# EAGLE schematic Dveri_Zapaishek (EAGLE 7.0.0)
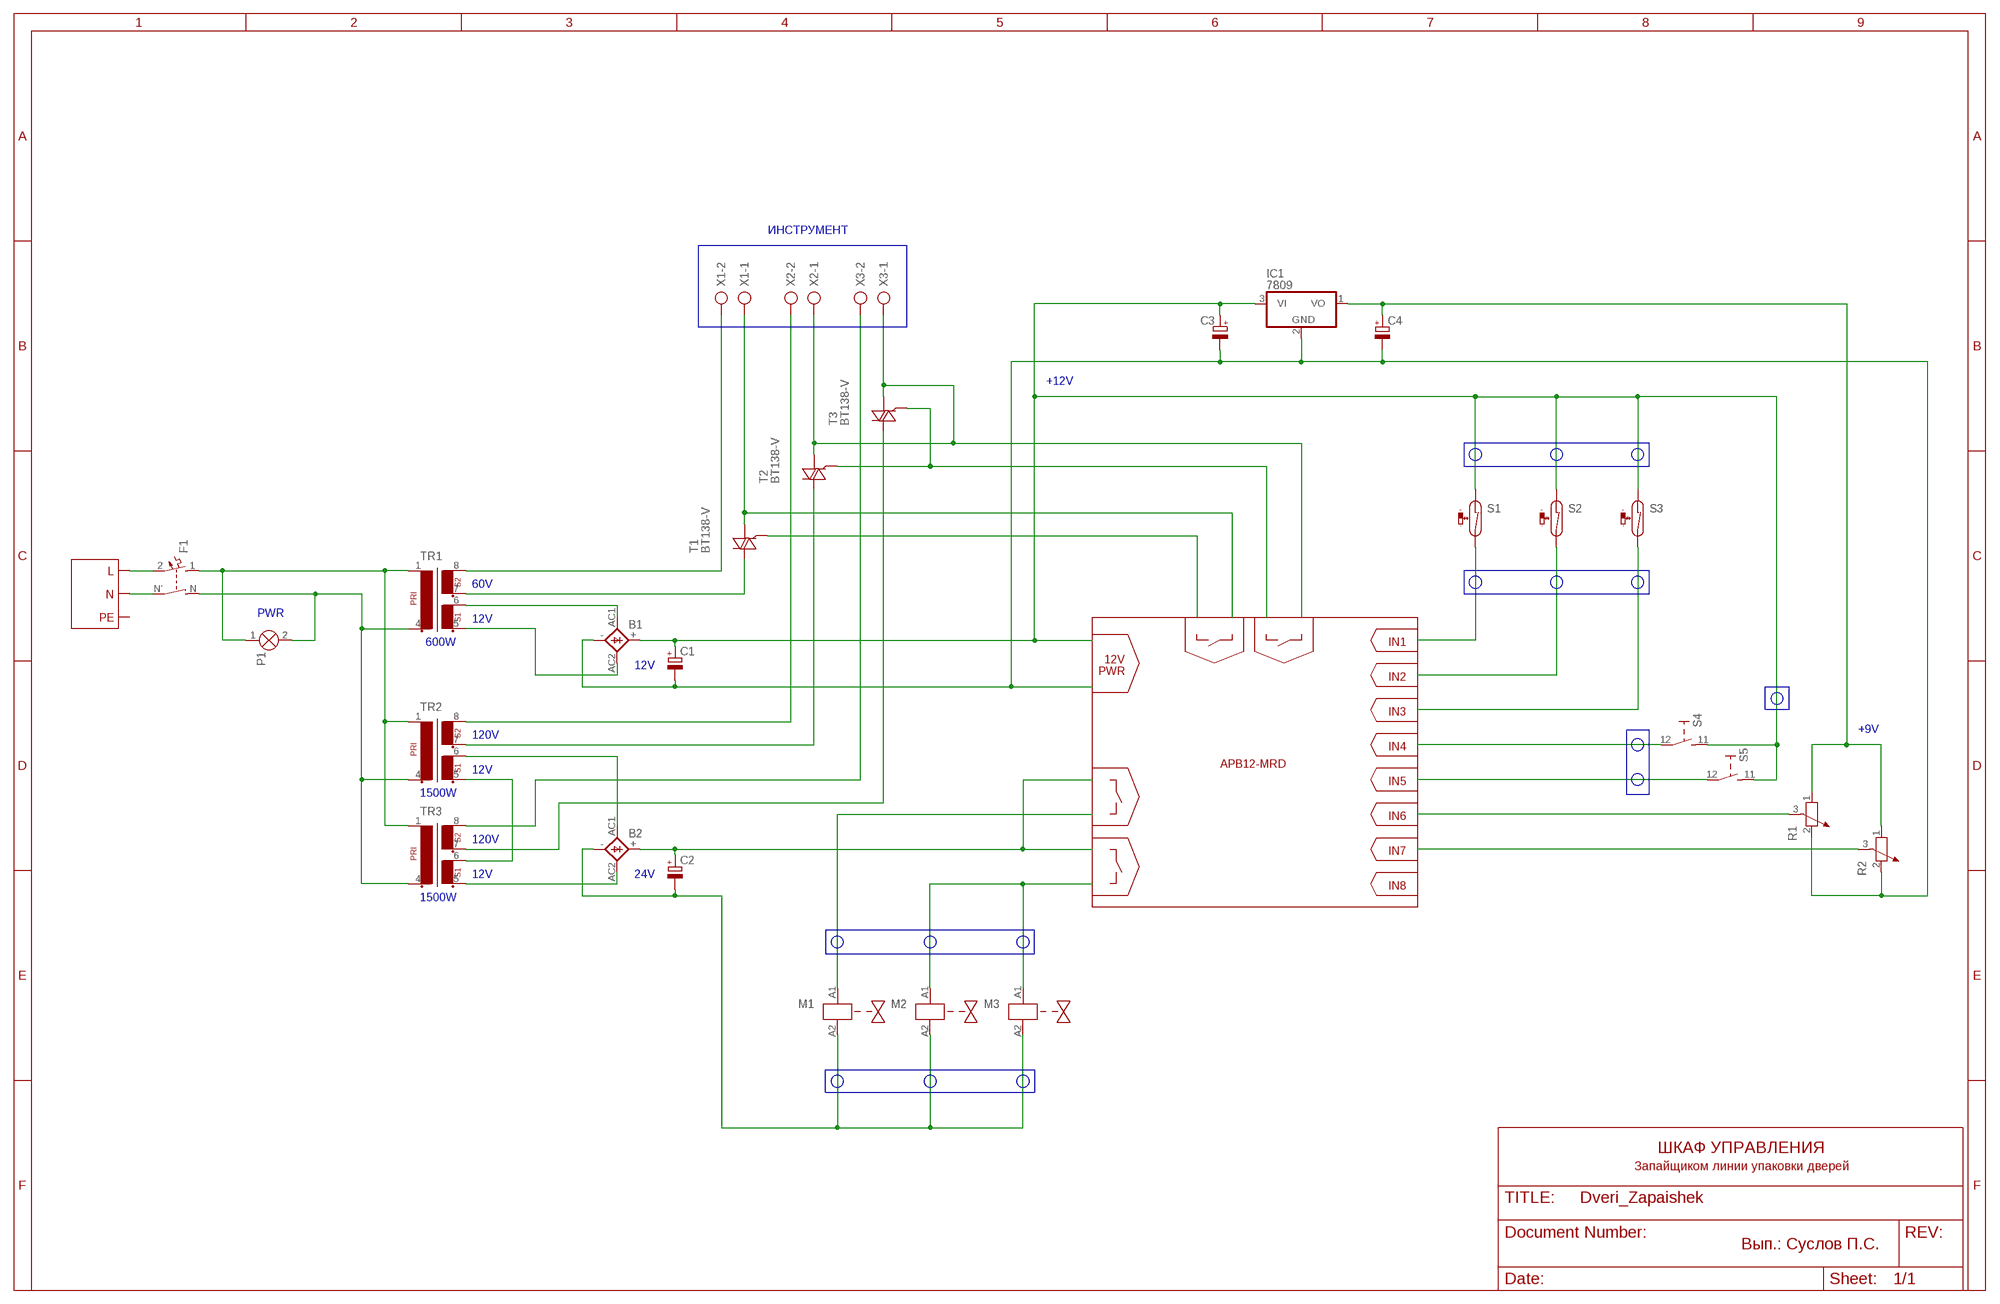
[diagram p0: schematic, sheet 1]

## Parts
B1  2KBP  [2KBP]
B2  2KBP  [2KBP]
C1  CPOL-EUE3.5-10  [E3,5-10]
C2  CPOL-EUE3.5-10  [E3,5-10]
C3  CPOL-EUE3.5-10  [E3,5-10]
C4  CPOL-EUE3.5-10  [E3,5-10]
F1  LEITUNGSSCHUTZSCHALTER_2-POL  [LEITUNGSSCHUTZSCHALTER_2-POL]
IC1  7809  7808L  [TO92]
M1  ELEKTROMAG_BETAETIGTES_MAGNETVENTIL_PNEUMATIK_HYDRAULIK  [MAGNETVENTIL_PNEUMATIK-HYDRAULIK]
M2  ELEKTROMAG_BETAETIGTES_MAGNETVENTIL_PNEUMATIK_HYDRAULIK  [MAGNETVENTIL_PNEUMATIK-HYDRAULIK]
M3  ELEKTROMAG_BETAETIGTES_MAGNETVENTIL_PNEUMATIK_HYDRAULIK  [MAGNETVENTIL_PNEUMATIK-HYDRAULIK]
P1  SIGNALLAMPE  [LAMPE]
R1  POTENTIOMETER_PT-10  [PT-10]
R2  POTENTIOMETER_PT-10  [PT-10]
S1  REED-SWITCH-CT10-1530-G1  [CT10-G1]
S2  REED-SWITCH-CT10-1530-G1  [CT10-G1]
S3  REED-SWITCH-CT10-1530-G1  [CT10-G1]
S4  SCHALTER_SCHLIESSER_HANDBETAETIGT  [KIPPSCHALTER_AUS]
S5  SCHALTER_SCHLIESSER_HANDBETAETIGT  [KIPPSCHALTER_AUS]
T1  BT138-V  [TO220BV]
T2  BT138-V  [TO220BV]
T3  BT138-V  [TO220BV]
TR1  EE20-2  [EE20-2]
TR2  EE20-2  [EE20-2]
TR3  EE20-2  [EE20-2]
X1  AK500/2  [AK500/2]
X2  AK500/2  [AK500/2]
X3  AK500/2  [AK500/2]

## Nets
L-EXT: F1.2
N$1: F1.N P1.2(X2) TR1.4 TR2.4 TR3.4
N$2: F1.1 P1.1(X1) TR1.1 TR2.1 TR3.1
N$3: B2.AC2 TR3.5
N$4: TR2.5 TR3.6
N$5: B2.AC1 TR2.6
N$6: B1.AC1 TR1.6
N$7: B1.AC2 TR1.5
N$8: B2.- C2.- M1.A2 M2.A2 M3.A2
N$9: T2.T1(A1) T3.T1(A1) X2.1 X3.1
N$10: B1.+ C1.+ C3.+ IC1.3(VI) S1.1 S2.1 S3.1 S4.11(CS1) S5.11(CS1)
N$12: T1.T2(A2) TR1.7
N$13: TR1.8 X1.2
N$14: T2.T2(A2) TR2.7
N$15: TR2.8 X2.2
N$16: T3.T2(A2) TR3.7
N$17: TR3.8 X3.2
N$19: B2.+ C2.+
N$20: M1.A1
N$21: M2.A1 M3.A1
N$22: T1.T1(A1) X1.1
N$23: T1.G
N$24: T2.G T3.G
N$25: S1.2
N$26: S2.2
N$27: S3.2
N$28: S4.12(S1)
N$29: S5.12(S1)
N$31: B1.- C1.- C3.- C4.- IC1.2(GND) R1.2 R2.2
N$32: R2.3
N$33: R1.3
N$34: C4.+ IC1.1(VO) R1.1 R2.1
N-EXT: F1.N'(N)

## Buses
B$1
B$2
B$3
B$4
B$5
B$6
B$7

## Notes on the sheet
- ИНСТРУМЕНТ
- +12V
- 60V
- PWR
- 12V
- 600W | IN1
- 12V
- 12V
- PWR
- IN2
- IN3
- +9V
- 120V
- IN4
- APB12-MRD
- 12V
- IN5
- 1500W
- IN6
- 120V
- IN7
- 12V | 24V
- IN8
- 1500W
- ШКАФ УПРАВЛЕНИЯ
- Запайщиком линии упаковки дверей
- Вып.: Суслов П.С.

## Library data of the parts
B1 B2 = rectifier:2KBP: RECTIFIER grid 3 x 3,81 mm
C1-C4 = rcl:CPOL-EU: POLARIZED CAPACITOR, European symbol
F1 = e-sicherungen:LEITUNGSSCHUTZSCHALTER_2-POL: Leitungsschutzschalter, 2-pol.
IC1 = linear:78*: Positive VOLTAGE REGULATOR Source: http://cache.national.com/ds/LM/LM78L05.pdf http://www.fairchildsemi.com/ds/LM/LM7805.pdf
M1-M3 = e-elektromechanische-antriebe:ELEKTROMAG_BETAETIGTES_MAGNETVENTIL_PNEUMATIK_HYDRAULIK: Pneumatik-Hydraulik-Ventil
P1 = e-lampen-signalisation:SIGNALLAMPE: Lampe
R1 R2 = rcl:POTENTIOMETER_: Potentiometer
S1-S3 = switch-reed:REED-SWITCH-: Reed Sensor; MF: COTO TECHNOLOGY; MPN: CT10-1530-G1; OC_FARNELL: 1081696
S4 S5 = e-schalter:SCHALTER_SCHLIESSER_HANDBETAETIGT: Schließer
T1-T3 = triac:BT138: TRIAC Source: http://www.semiconductors.philips.com BT138_SERIES_2.pdf
TR1-TR3 = trafo:EE20-2: TRANSFORMER 1 primary winding, 2 secondary windings ERA
X1-X3 = con-ptr500:AK500/2: CONNECTOR; OC_FARNELL: unknown; OC_NEWARK: unknown